# Altium schematic sheet LNBF.SchDoc
size A; SheetNumber: 1; SheetTotal: 2
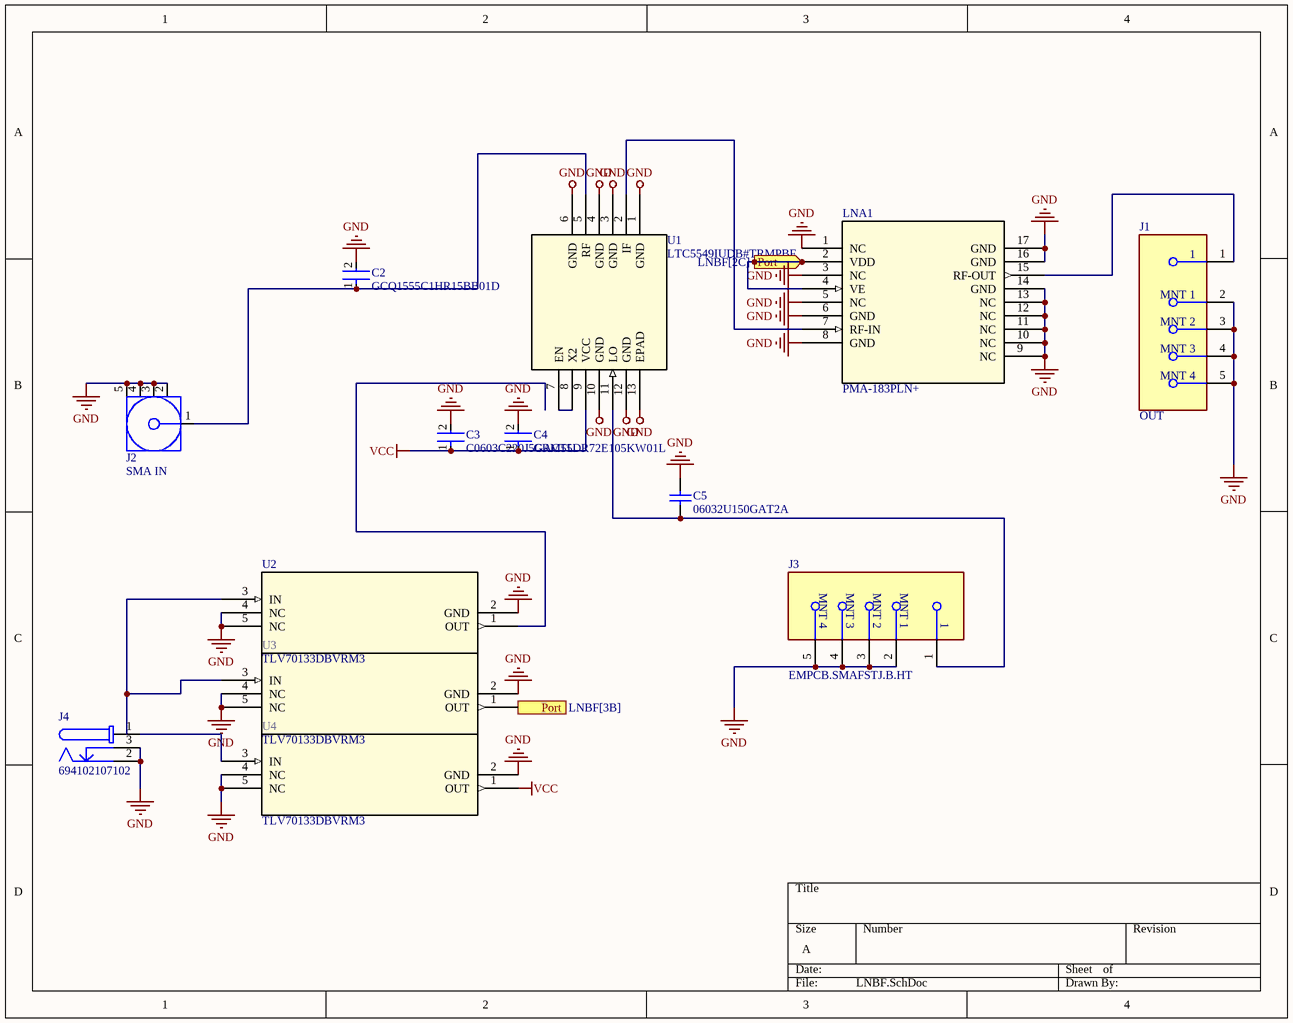
[diagram p0: LNBF.SchDoc]

## Parts
C2  GCQ1555C1HR15BB01D  [FP-GCQ155-0_05-MFG]
C3  C0603C220J5GACTU  [FP-C0603C-CF-MFG]
C4  GRM55DR72E105KW01L  [FP-GRM55D-0_4-IPC_A]
C5  06032U150GAT2A  [CAPC1508X91X25LL25T13]
J1  OUT  [FP-EMPCB_SMAFSTJ_B_HT-MFG]
J2  SMA IN  [MOLX-731000114_V]
J3  EMPCB.SMAFSTJ.B.HT  [FP-EMPCB_SMAFSTJ_B_HT-MFG]
J4  694102107102  [694102107102]
LNA1  PMA-183PLN+  [JV2579_MNC]
U1  LTC5549IUDB#TRMPBF  [LTC5549IUDBTRMPBF_ADI]
U2  TLV70133DBVRM3  [DBV5]
U3  TLV70133DBVRM3  [DBV5]
U4  TLV70133DBVRM3  [DBV5]

## Ports
Port (in, see LNBF[2C]), Port (see LNBF[3B])

## Nets
GND: C2.2 C3.2 C4.2 C5.1 J1.2(MNT_1) J1.3(MNT_2) J1.4(MNT_3) J1.5(MNT_4) J2.2 J2.3 J2.4 J2.5 J3.2(MNT_1) J3.3(MNT_2) J3.4(MNT_3) J3.5(MNT_4) J4.2 J4.3 LNA1.1(NC) LNA1.3(NC) LNA1.5(NC) LNA1.6(GND) LNA1.8(GND) LNA1.9(NC) LNA1.10(NC) LNA1.11(NC) LNA1.12(NC) LNA1.13(NC) LNA1.14(GND) LNA1.16(GND) LNA1.17(GND) U1.1(GND) U1.3(GND) U1.4(GND) U1.6(GND) U1.10(GND) U1.12(GND) U1.13(EPAD) U2.2(GND) U2.4(NC) U2.5(NC) U3.2(GND) U3.4(NC) U3.5(NC) U4.2(GND) U4.4(NC) U4.5(NC)
VCC: C3.1 C4.1 U1.9(VCC) U4.1(OUT)
Port: LNA1.2(VDD) LNA1.4(VE) U3.1(OUT) ; port Port
NetC2_1: C2.1 J2.1 U1.5(RF)
NetC5_2: C5.2 J3.1 U1.11(LO)
NetJ1_1: J1.1 LNA1.15(RF-OUT)
NetJ4_1: J4.1 U4.3(IN)
NetLNA1_7: LNA1.7(RF-IN) U1.2(IF)
NetU1_7: U1.7(EN) U1.8(X2)
NetU2_3: U2.3(IN) U3.3(IN)

Not connected (* = marked no-connect by the designer): U2 1(OUT)

## Library data of the parts
C2 = CMP-06035-056453-1: High Q Ceramic Capacitor for Automotive 0.15pF ±0.1pF 50VDC C0G 0402 Paper T/R
C3 = CMP-2006-03119-3: Cap Ceramic 22pF 50V C0G 5% SMD 0603 125°C Paper T/R; Manufacturer: KEMET; Temperature Coefficient: 30ppm/°C; Automotive Grade: Grade 1; Tolerance: 0.05; RoHS: TRUE; Temperature Characteristic: C0G; Capacitance: 22 pF; Device Class L3: Ceramic Capacitors; Digikey Description: Cap Ceramic 22pF 50V C0G 5% SMD 0603 125°C Paper T/R; ComponentLink2URL: https://api.kemet.com/component-edge/download/datasheet/C0603C100J5GACAUTO.pdf; ComponentLink2Description: Datasheet; Automotive: Yes; Temperature: -55°C to +125°C; Temperature Range High: +125°C; Package: C0603C-CF; Device Class L1: Passive Components; Device Class L2: Capacitors; Lead Free: Yes; Value: 22 pF; Manufacturer Part Number: C0603C220J5GACTU; Category: Cap; Mouser Description: Cap Ceramic 22pF 50V C0G 5% SMD 0603 125°C Paper T/R; Voltage Rating: 50 V; Height: 0.87mm; Material: Ceramic; Temperature Range Low: -55°C; Octopart: https://octopart.com/c0603c220j5gactu-kemet-98525
C4 = CMP-2000-06370-2: Chip Multilayer Ceramic Capacitors for General Purpose, 2220, 1.0uF, X7R, 15%, 10%, 250V; Capacitance: 1uF; Width: 5mm; Height: 2mm; Case Code (Imperial): 2220; Voltage Rating (DC): 250V; Max Operating Temperature: 125°C; Number of Pins: 2; Min Operating Temperature: -55°C; Termination: SMD/SMT; Case/Package: 2220; Dielectric: X7R; Material: Ceramic; REACH SVHC: No SVHC; Voltage: 250V; Packaging: Tape and Reel; Thickness: 0.087inch; Depth: 5mm; Package Quantity: 1; Tolerance: 10%; Mount: Surface Mount; Voltage Rating: 250V; Length: 5.7mm; Case Code (Metric): 5750; Lead Free: Lead Free
C5 = CMP-2006-04659-1: Manufacturer: AVX Interconnect / Elco; Part Number: 06032U150GAT2A
J1 = CMP-111093-000001-1: CONN SMA JACK STR 50OHM EDGE MNT; Manufacturer Part Number: EMPCB.SMAFSTJ.B.HT; Manufacturer: Taoglas Limited; Conn Orientation: Horizontal; Frequency: 12.4GHz; Impedance: 50Ω; Voltage Rating: 335V; Is Female: yes; Pitch: 2.62mm; Number Of Contacts: 1; Device Class L2: RF / Coaxial Connectors; Category: Conn; Contact Material: Gold; Device Class L1: Connectors; Digikey Description: CONN SMA JACK STR 50OHM EDGE MNT; Temperature Range Low: -40°C; Octopart: https://octopart.com/empcb.smafstj.b.ht-taoglas-24204431; ComponentLink2URL: https://cdn.taoglas.com/datasheets/EMPCB.SMAFSTJ.B.HT.pdf; Temperature Range High: +85°C; Device Class L3: unset; Temperature: -40°C to +85°C; Package: 0; RoHS: TRUE; Lead Free: Yes; Automotive: No; ComponentLink2Description: Datasheet; Mouser Description: RF Connectors / Coaxial Connectors SMA Straight Edge Mount PCB Jack-Gold
J2 = CMP-2000-05487-1: SMA Right-Angle PCB Jack Receptacle, Brass Body, Gold Plated, 50 Ohm, 5-Pin THD, RoHS, Tray; Manufacturer: Molex; Datasheet Version: 09/2016; Package Description: 5-Pin Through Hole Device, Body 14.8 x 6.35 mm, Pitch 2.54 mm; Datasheet URL: http://www.molex.com/webdocs/datasheets/pdf/en-us/0731000114_RF_COAX_CONNECTORS.pdf; Manufacturer URL: http://www.molex.com/; Package Reference: 731000114; Mounting Technology: ThroughHole; Package URL: http://www.molex.com/pdm_docs/sd/731000114_sd.pdf
J3 = CMP-111093-000001-1: CONN SMA JACK STR 50OHM EDGE MNT; Manufacturer: Taoglas Limited; Conn Orientation: Horizontal; Frequency: 12.4GHz; Impedance: 50Ω; Voltage Rating: 335V; Is Female: yes; Pitch: 2.62mm; Number Of Contacts: 1; Device Class L2: RF / Coaxial Connectors; Category: Conn; Contact Material: Gold; Device Class L1: Connectors; Digikey Description: CONN SMA JACK STR 50OHM EDGE MNT; Temperature Range Low: -40°C; Octopart: https://octopart.com/empcb.smafstj.b.ht-taoglas-24204431; ComponentLink2URL: https://cdn.taoglas.com/datasheets/EMPCB.SMAFSTJ.B.HT.pdf; Temperature Range High: +85°C; Device Class L3: unset; Temperature: -40°C to +85°C; Package: 0; RoHS: TRUE; Lead Free: Yes; Automotive: No; ComponentLink2Description: Datasheet; Mouser Description: RF Connectors / Coaxial Connectors SMA Straight Edge Mount PCB Jack-Gold; Manufacturer Part Number: EMPCB.SMAFSTJ.B.HT
J4 = CMP-1502-00174-2: NexarPartId: 52645180; Connector Type: Power; Insulation Resistance: 100MΩ; Gender: Male; Current Rating: 5A; Voltage Rating: 18V; Shielding: Unshielded; Mount: Surface Mount; Packaging: Tape and Reel; Max Operating Temperature: 85°C; Color: Black; Contact Plating: Tin; Min Operating Temperature: -40°C; Housing Material: Polyamide; Termination: SMD/SMT; RoHS: Compliant; Contact Gender: Female; REACH SVHC: Unknown; Voltage Rating (DC): 18V; Operating Supply Voltage: 18V; Flammability Rating: UL94 V-0
LNA1 = PMA-183PLN+: No Description Available; Mfr_Name: Mini Circuits; Copyright: Copyright (C) 2024 Ultra Librarian. All rights reserved.; Manufacturer_Part_Number: PMA-183PLN+; RefDes: RefDes; Type: DEV
U1 = LTC5549IUDBTRMPBF: No Description Available; Mfr_Name: Analog Devices Inc; Copyright: Copyright (C) 2024 Ultra Librarian. All rights reserved.; Manufacturer_Part_Number: LTC5549IUDB#TRMPBF; RefDes: RefDes; Type: DEV
U2-U4 = TLV70133DBVRM3: No Description Available; Mfr_Name: Texas Instruments; Copyright: Copyright (C) 2024 Ultra Librarian. All rights reserved.; Manufacturer_Part_Number: TLV70133DBVRM3; RefDes: RefDes; Type: DEV